# Altium schematic sheet CC_CR_CP_Mode.SchDoc
size A3; SheetNumber: 1; SheetTotal: 2
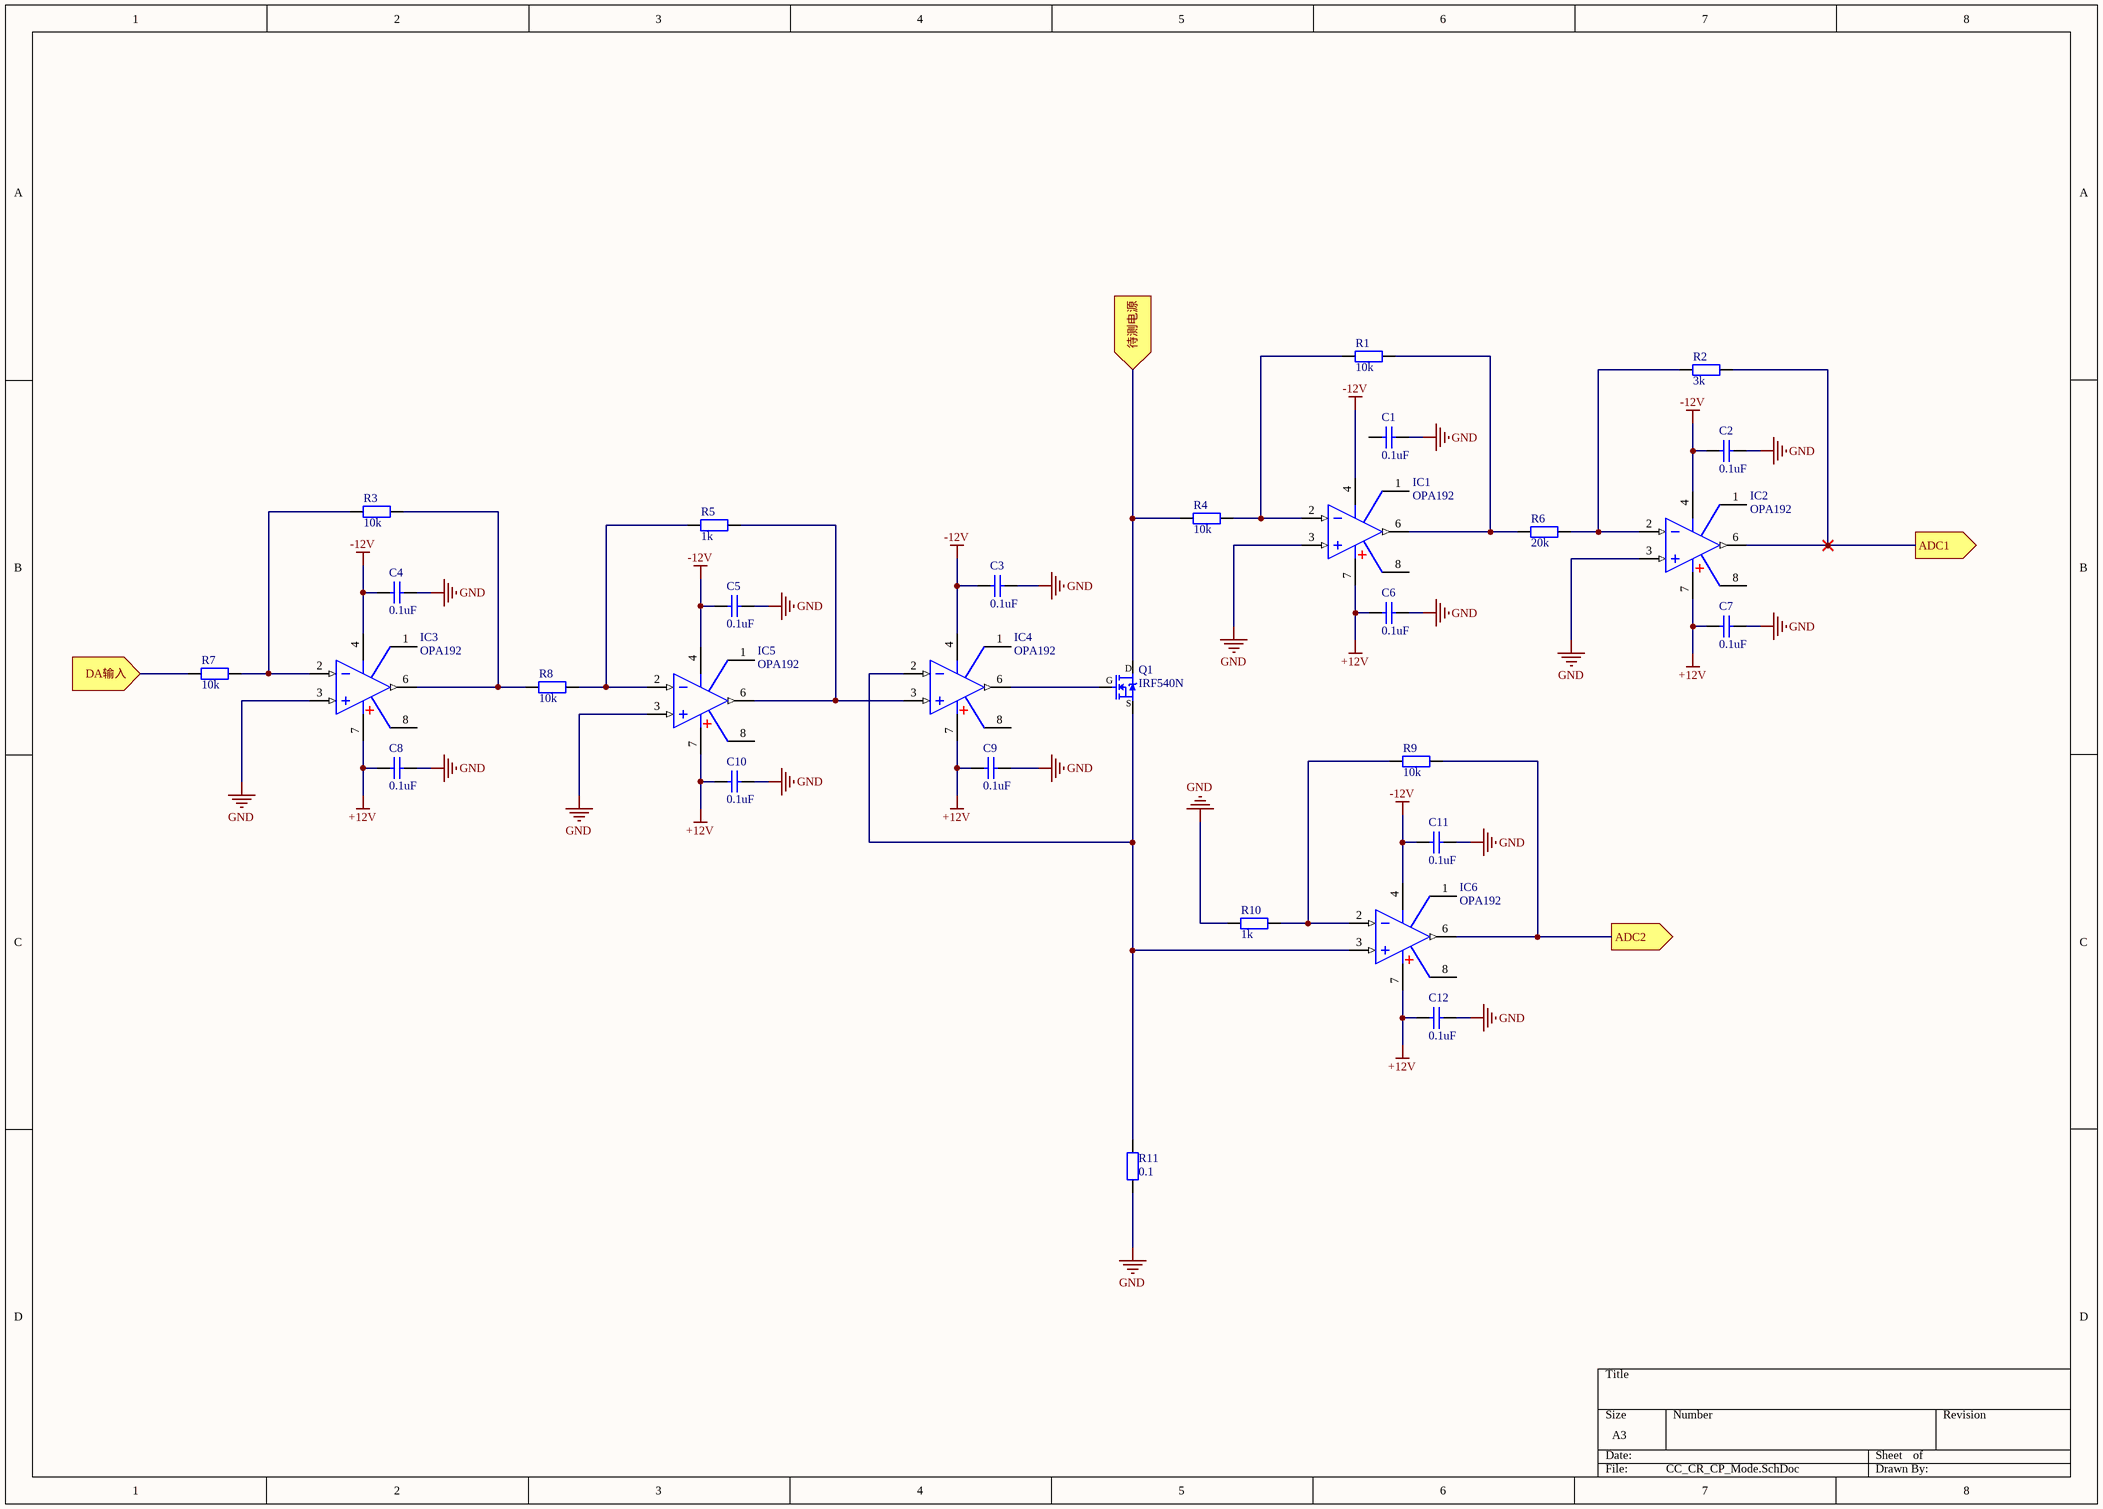
[diagram p0: CC_CR_CP_Mode.SchDoc]

## Parts
C1  0.1uF  [瓷片电容]
C2  0.1uF  [瓷片电容]
C3  0.1uF  [瓷片电容]
C4  0.1uF  [瓷片电容]
C5  0.1uF  [瓷片电容]
C6  0.1uF  [瓷片电容]
C7  0.1uF  [瓷片电容]
C8  0.1uF  [瓷片电容]
C9  0.1uF  [瓷片电容]
C10  0.1uF  [瓷片电容]
C11  0.1uF  [瓷片电容]
C12  0.1uF  [瓷片电容]
IC1  OPA192  [SOP8_N]
IC2  OPA192  [SOP8_N]
IC3  OPA192  [SOP8_N]
IC4  OPA192  [SOP8_N]
IC5  OPA192  [SOP8_N]
IC6  OPA192  [SOP8_N]
Q1  IRF540N  [TO263-3B]
R1  10k  [RS 1/4W]
R2  3k  [RS 1/4W]
R3  10k  [RS 1/4W]
R4  10k  [RS 1/4W]
R5  1k  [RS 1/4W]
R6  20k  [RS 1/4W]
R7  10k  [RS 1/4W]
R8  10k  [RS 1/4W]
R9  10k  [RS 1/4W]
R10  1k  [RS 1/4W]
R11  0.1  [RS 1/4W]

## Ports
ADC1 (out), ADC2 (out), DA输入 (in), 待测电源 (in)

## Nets
+12V: C6.1 C7.1 C8.1 C9.1 C10.1 C12.1 IC1.7(V+) IC2.7(V+) IC3.7(V+) IC4.7(V+) IC5.7(V+) IC6.7(V+)
-12V: C2.1 C3.1 C4.1 C5.1 C11.1 IC1.4(V-) IC2.4(V-) IC3.4(V-) IC4.4(V-) IC5.4(V-) IC6.4(V-)
GND: C1.2 C2.2 C3.2 C4.2 C5.2 C6.2 C7.2 C8.2 C9.2 C10.2 C11.2 C12.2 IC1.3(IN+) IC2.3(IN+) IC3.3(IN+) IC5.3(IN+) R10.1 R11.1
ADC1: IC2.6(OUT) R2.2 ; port ADC1
ADC2: IC6.6(OUT) R9.2 ; port ADC2
DA输入: R7.1 ; port DA输入
待测电源: Q1.2(S) R4.1 ; port 待测电源
NetIC1_2: IC1.2(IN-) R1.1 R4.2
NetIC1_6: IC1.6(OUT) R1.2 R6.1
NetIC2_2: IC2.2(IN-) R2.1 R6.2
NetIC3_2: IC3.2(IN-) R3.1 R7.2
NetIC3_6: IC3.6(OUT) R3.2 R8.1
NetIC4_2: IC4.2(IN-) IC6.3(IN+) Q1.3(D) R11.2
NetIC4_3: IC4.3(IN+) IC5.6(OUT) R5.2
NetIC4_6: IC4.6(OUT) Q1.1(G)
NetIC5_2: IC5.2(IN-) R5.1 R8.2
NetIC6_2: IC6.2(IN-) R9.1 R10.2

Not connected (* = marked no-connect by the designer): C1 1; IC1 1 8; IC2 1 8; IC3 1 8; IC4 1 8; IC5 1 8; IC6 1 8

## Library data of the parts
C1-C12 = Cap_DIP: 直插电容; Value: 100nF; Voltage: 63V; Published: 8-Jun-2000; Revision: July-2002: Re-released for DXP Platform.; Publisher: Altium Limited; 实物样品照片: https://item.taobao.com/item.htm?spm=a230r.1.14.32.21fd24b7VWml4d&id=37914290992&ns=1&abbucket=13#detail
IC1-IC6 = OPA192: High-Voltage, Rail-to-Rail Input/Output, 5µV, 0.2µV/˚C, Precision Operational Amplifier; BOM名称: 单路精密运放; 版权归属: 源创客; 学习资源: www.ooocke.com
Q1 = IRF540N: N沟场 100V/22A; BOM名称: 效应管; 版权归属: 源创客; 学习资源: www.ooocke.com; 描述: N沟场 100V/22A
R1-R11 = Res_DIP: 直插电阻